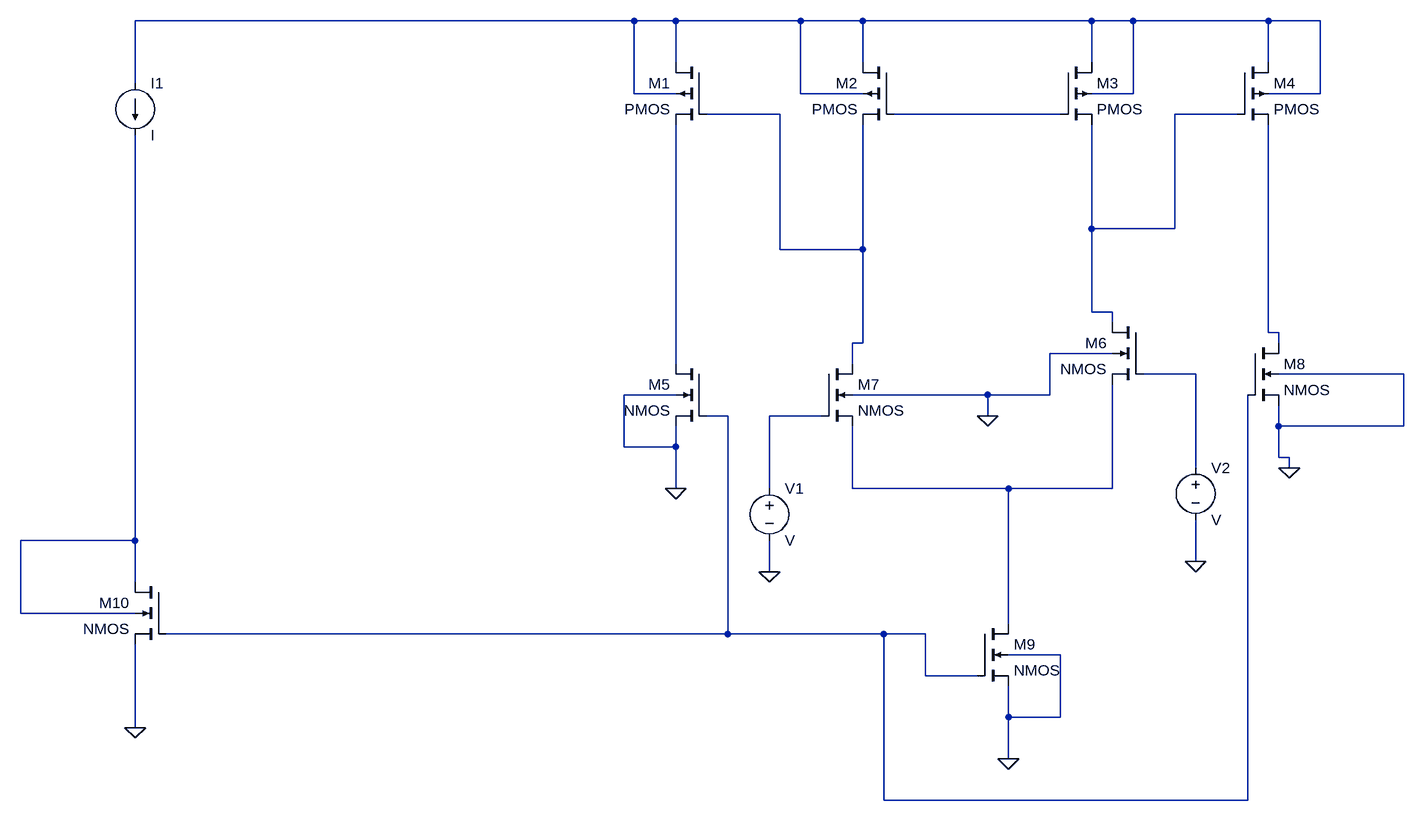
[diagram p0: schematic 2c_2stage.asc]
2c_2stage.asc, the LTspice schematic file:
Version 4
SHEET 1 1092 1060
WIRE -96 -144 -864 -144
WIRE -32 -144 -96 -144
WIRE 160 -144 -32 -144
WIRE 256 -144 160 -144
WIRE 608 -144 256 -144
WIRE 672 -144 608 -144
WIRE 880 -144 672 -144
WIRE 960 -144 880 -144
WIRE -32 -80 -32 -144
WIRE 256 -80 256 -144
WIRE 608 -80 608 -144
WIRE 880 -80 880 -144
WIRE -864 -48 -864 -144
WIRE -96 -32 -96 -144
WIRE -32 -32 -96 -32
WIRE 160 -32 160 -144
WIRE 256 -32 160 -32
WIRE 672 -32 672 -144
WIRE 672 -32 608 -32
WIRE 960 -32 960 -144
WIRE 960 -32 880 -32
WIRE 128 0 16 0
WIRE 560 0 304 0
WIRE 832 0 736 0
WIRE 608 176 608 16
WIRE 736 176 736 0
WIRE 736 176 608 176
WIRE 128 208 128 0
WIRE 256 208 256 16
WIRE 256 208 128 208
WIRE 608 304 608 176
WIRE 640 304 608 304
WIRE 640 320 640 304
WIRE 880 336 880 16
WIRE 896 336 880 336
WIRE 256 352 256 208
WIRE 256 352 240 352
WIRE 896 352 896 336
WIRE 640 368 544 368
WIRE -32 384 -32 16
WIRE 240 384 240 352
WIRE 768 400 688 400
WIRE 1088 400 896 400
WIRE -32 432 -112 432
WIRE 448 432 240 432
WIRE 544 432 544 368
WIRE 544 432 448 432
WIRE 48 464 16 464
WIRE 192 464 112 464
WIRE 448 464 448 432
WIRE 896 480 896 448
WIRE 1088 480 1088 400
WIRE 1088 480 896 480
WIRE -112 512 -112 432
WIRE -32 512 -32 480
WIRE -32 512 -112 512
WIRE 896 528 896 480
WIRE 912 528 896 528
WIRE 768 544 768 400
WIRE 912 544 912 528
WIRE -32 576 -32 512
WIRE 112 576 112 464
WIRE 240 576 240 480
WIRE 480 576 240 576
WIRE 640 576 640 416
WIRE 640 576 480 576
WIRE -864 656 -864 32
WIRE -864 656 -1040 656
WIRE 768 688 768 624
WIRE 112 704 112 656
WIRE -864 720 -864 656
WIRE -1040 768 -1040 656
WIRE -864 768 -1040 768
WIRE 480 784 480 576
WIRE 48 800 48 464
WIRE 48 800 -816 800
WIRE 288 800 48 800
WIRE 352 800 288 800
WIRE 560 832 480 832
WIRE 352 864 352 800
WIRE 432 864 352 864
WIRE 480 928 480 880
WIRE 560 928 560 832
WIRE 560 928 480 928
WIRE -864 944 -864 816
WIRE 480 992 480 928
WIRE 288 1056 288 800
WIRE 848 1056 848 432
WIRE 848 1056 288 1056
FLAG -32 576 0
FLAG 912 544 0
FLAG -864 944 0
FLAG 480 992 0
FLAG 112 704 0
FLAG 768 688 0
FLAG 448 464 0
SYMBOL pmos4 16 -80 M0
SYMATTR InstName M1
SYMBOL pmos4 304 -80 M0
SYMATTR InstName M2
SYMBOL pmos4 560 -80 R0
SYMATTR InstName M3
SYMBOL pmos4 832 -80 R0
SYMATTR InstName M4
SYMBOL nmos4 16 384 M0
SYMATTR InstName M5
SYMBOL nmos4 688 320 M0
SYMATTR InstName M6
SYMBOL nmos4 192 384 R0
SYMATTR InstName M7
SYMBOL nmos4 848 352 R0
SYMATTR InstName M8
SYMBOL current -864 -48 R0
SYMATTR InstName I1
SYMBOL nmos4 432 784 R0
SYMATTR InstName M9
SYMBOL nmos4 -816 720 M0
SYMATTR InstName M10
SYMBOL voltage 112 560 R0
SYMATTR InstName V1
SYMBOL voltage 768 528 R0
SYMATTR InstName V2

The netlist it stands for:
* 2c_2stage.asc
M1 N001 N002 N006 N001 PMOS
M2 N001 N003 N002 N001 PMOS
M3 N001 N003 N004 N001 PMOS
M4 N001 N004 N005 N001 PMOS
M5 N006 N008 0 0 NMOS
M6 N004 N007 N010 0 NMOS
M7 N002 N009 N010 0 NMOS
M8 N005 N008 0 0 NMOS
I1 N001 N011 I
M9 N010 N008 0 0 NMOS
M10 N011 N008 0 N011 NMOS
V1 N009 0 V
V2 N007 0 V
.model NMOS NMOS
.model PMOS PMOS
.lib standard.mos
.backanno
.end